# EAGLE design linearSensor (EAGLE 7.3.0)
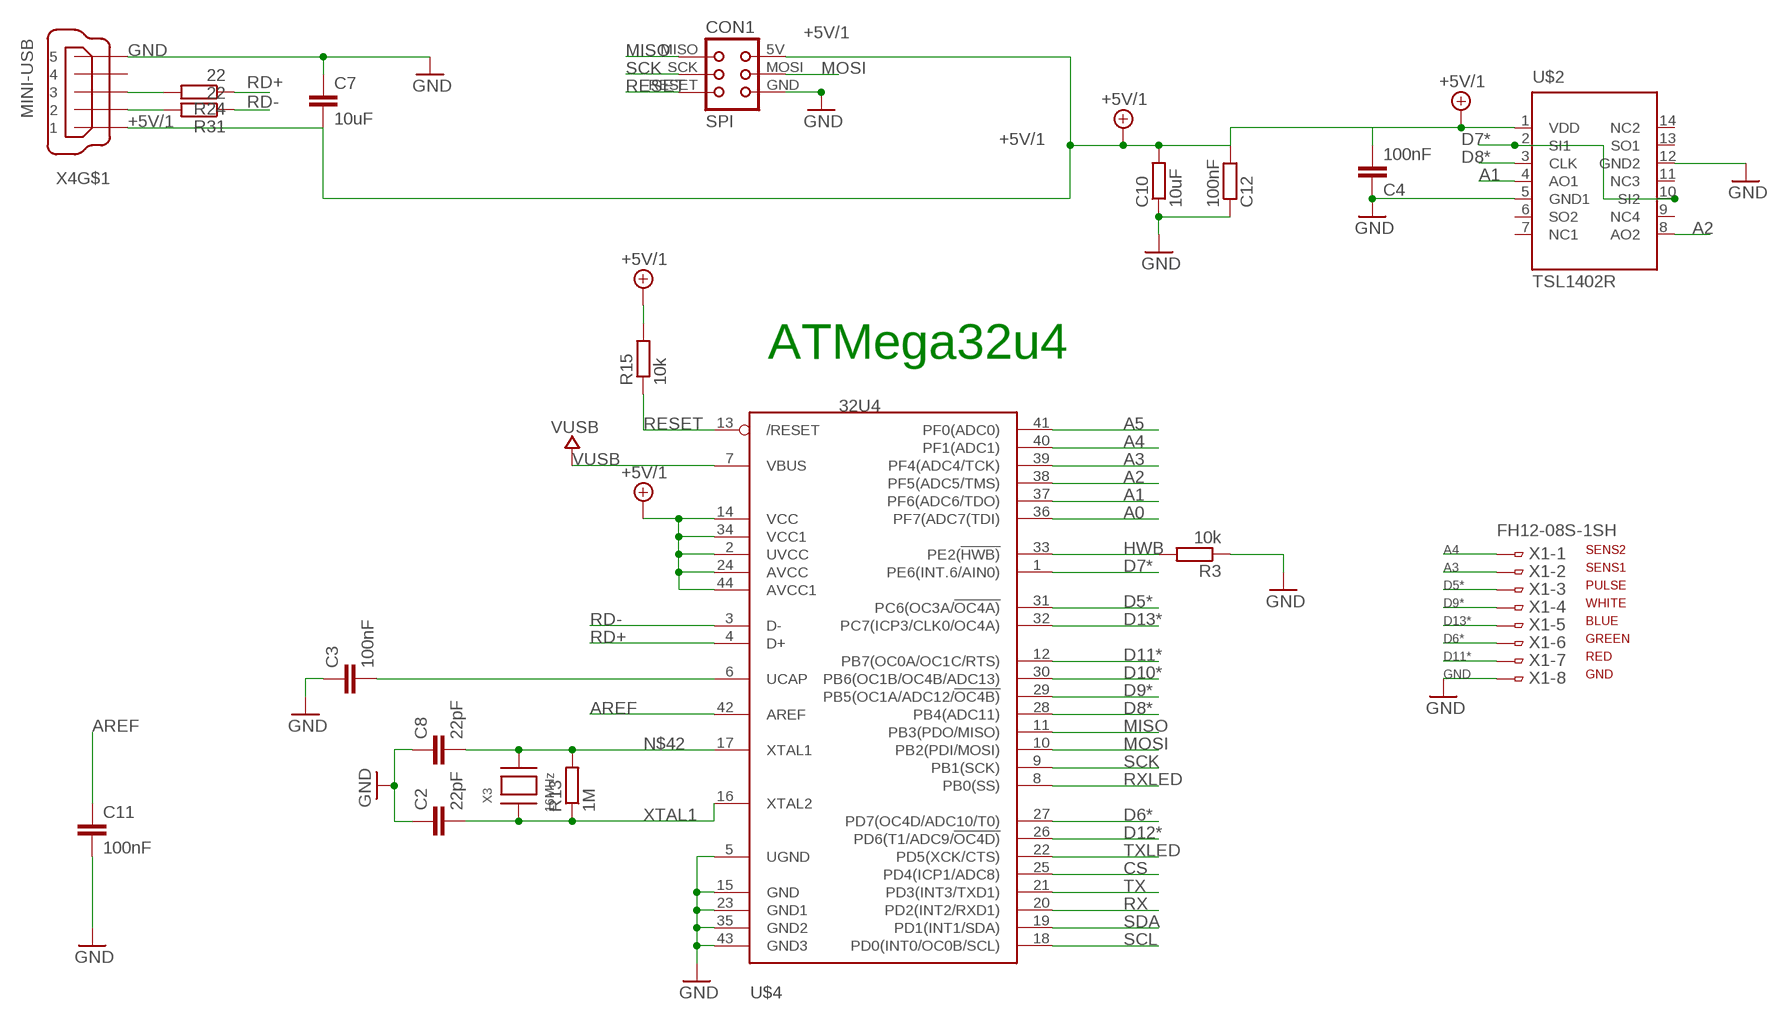
[diagram p0: schematic, sheet 1]

## Parts
C2  22pF  C-EUC0805K  [C0805K]
C3  100nF  C-EUC0805K  [C0805K]
C4  100nF  C-EUC0805  [C0805]
C7  10uF  C-EUC0805  [C0805]
C8  22pF  C-EUC0805K  [C0805K]
C10  10uF  R-EU_M0805  [M0805]
C11  100nF  C-EUC0805K  [C0805K]
C12  100nF  R-EU_M0805  [M0805]
CON1  SPI  TINYISPT  [TC2030-MCP-NL]
R3  10k  R-EU_M0805  [M0805]
R13  1M  R-EU_M0805  [M0805]
R15  10k  R-EU_M0805  [M0805]
R24  22  R-EU_M0805  [M0805]
R31  22  R-EU_M0805  [M0805]
U$2  TSL1402R  [DIL14]
U$4  32U4  ATMEGA32U4-AU  [TQFP44]
X1  FH12-08S-1SH  [FH12-08S-1SH]
X3  16MHz  XTALNX6035  [NX6035]
X4  MINI-USB  MINI-USB-SCHIELD-32005-201  [32005-201]

## Nets
+5V/1 [fine]: C4.2 C7.2 C10.2 C12.2 CON1.5V(VCC) R15.2 U$2.1(VDD) U$4.2(UVCC) U$4.14(VCC) U$4.24(AVCC) U$4.34(VCC1) U$4.44(AVCC1) X4.1
A0: U$4.36(PF7(ADC7(TDI))
A1: U$2.4(AO1) U$4.37(PF6(ADC6/TDO))
A2: U$2.8(AO2) U$4.38(PF5(ADC5/TMS))
A3: U$4.39(PF4(ADC4/TCK)) X1.2
A4: U$4.40(PF1(ADC1)) X1.1
A5: U$4.41(PF0(ADC0))
AREF: C11.1 U$4.42(AREF)
CS: U$4.25(PD4(ICP1/ADC8))
D5*: U$4.31(PC6(OC3A/!OC4A)) X1.3
D6*: U$4.27(PD7(OC4D/ADC10/T0)) X1.6
D7*: U$2.2(SI1) U$2.10(SI2) U$4.1(PE6(INT.6/AIN0))
D8*: U$2.3(CLK) U$4.28(PB4(ADC11))
D9*: U$4.29(PB5(OC1A/ADC12/!OC4B)) X1.4
D10*: U$4.30(PB6(OC1B/OC4B/ADC13))
D11*: U$4.12(PB7(OC0A/OC1C/RTS)) X1.7
D12*: U$4.26(PD6(T1/ADC9/!OC4D))
D13*: U$4.32(PC7(ICP3/CLK0/OC4A)) X1.5
D_USB+ [USBA]: R24.2 X4.3
D_USB- [USBA]: R31.2 X4.2
GND [power]: C2.1 C3.1 C4.1 C7.1 C8.1 C10.1 C11.2 C12.1 CON1.GND R3.1 U$2.5(GND1) U$2.12(GND2) U$4.5(UGND) U$4.15(GND) U$4.23(GND1) U$4.35(GND2) U$4.43(GND3) X1.8 X4.5
HWB: R3.2 U$4.33(PE2(!HWB))
MISO: CON1.MISO U$4.11(PB3(PDO/MISO))
MOSI: CON1.MOSI U$4.10(PB2(PDI/MOSI))
N$16: C3.2 U$4.6(UCAP)
N$42: C8.2 R13.2 U$4.17(XTAL1) X3.P$2
RD+ [USBB]: R24.1 U$4.4(D+)
RD- [USBB]: R31.1 U$4.3(D-)
RESET: CON1.RESET R15.1 U$4.13(/RESET)
RX: U$4.20(PD2(INT2/RXD1))
RXLED: U$4.8(PB0(SS))
SCK: CON1.SCK U$4.9(PB1(SCK))
SCL: U$4.18(PD0(INT0/OC0B/SCL))
SDA: U$4.19(PD1(INT1/SDA))
TX: U$4.21(PD3(INT3/TXD1))
TXLED: U$4.22(PD5(XCK/CTS))
VUSB: U$4.7(VBUS)
XTAL1: C2.2 R13.1 U$4.16(XTAL2) X3.P$1
Unconnected: U$2.6(SO2) U$2.7(NC1) U$2.9(NC4) U$2.11(NC3) U$2.13(SO1) U$2.14(NC2) X4.4 X4.M1(S:S1) X4.M2(S:S2) X4.M3(S:S3) X4.M4(S:S4)

## Notes on the sheet
- ATMega32u4
- SENS2
- SENS1
- PULSE
- WHITE
- BLUE
- GREEN
- RED
- GND

## Library data of the parts
C2-C4 C7 C8 C11 = rcl:C-EU: CAPACITOR, European symbol
C10 C12 R13 R24 R31 = rcl:R-EU_: RESISTOR, European symbol
CON1 = lpatiny:TINYISP: CONNECTOR
R3 R15 = resistor:R-EU_: RESISTOR, European symbol
U$2 = lpatiny:TSL1402R
U$4 = adafruit:ATMEGA32U4: http://www.ladyada.net/library/eagle
X1 = con-hirose:FH12-08S-1S: 1mm Pitch Connectors For FPC/FFC Source: Data sheet <http://www.hirose.co.jp/cataloge_hp/e58605370.pdf>; OC_FARNELL: unknown; OC_NEWARK: unknown
X3 = lpatiny:XTAL: Low cost SMT crystals, no capacitors included http://www.ladyada.net/library/eagle
X4 = con-cypressindustries:MINI-USB-SCHIELD-: MINI USB-B Conector Source: www.cypressindustries.com; OC_FARNELL: unknown; OC_NEWARK: unknown

## Net classes
0 default: width 0.254 mm
1 power: width 0.254 mm
2 VIN: width 0.254 mm
3 fine: width 0.254 mm
4 aref: width 0.254 mm
5 USBA: width 0.254 mm, clearance 0.254 mm
6 USBB: width 0.254 mm, clearance 0.254 mm

## Board
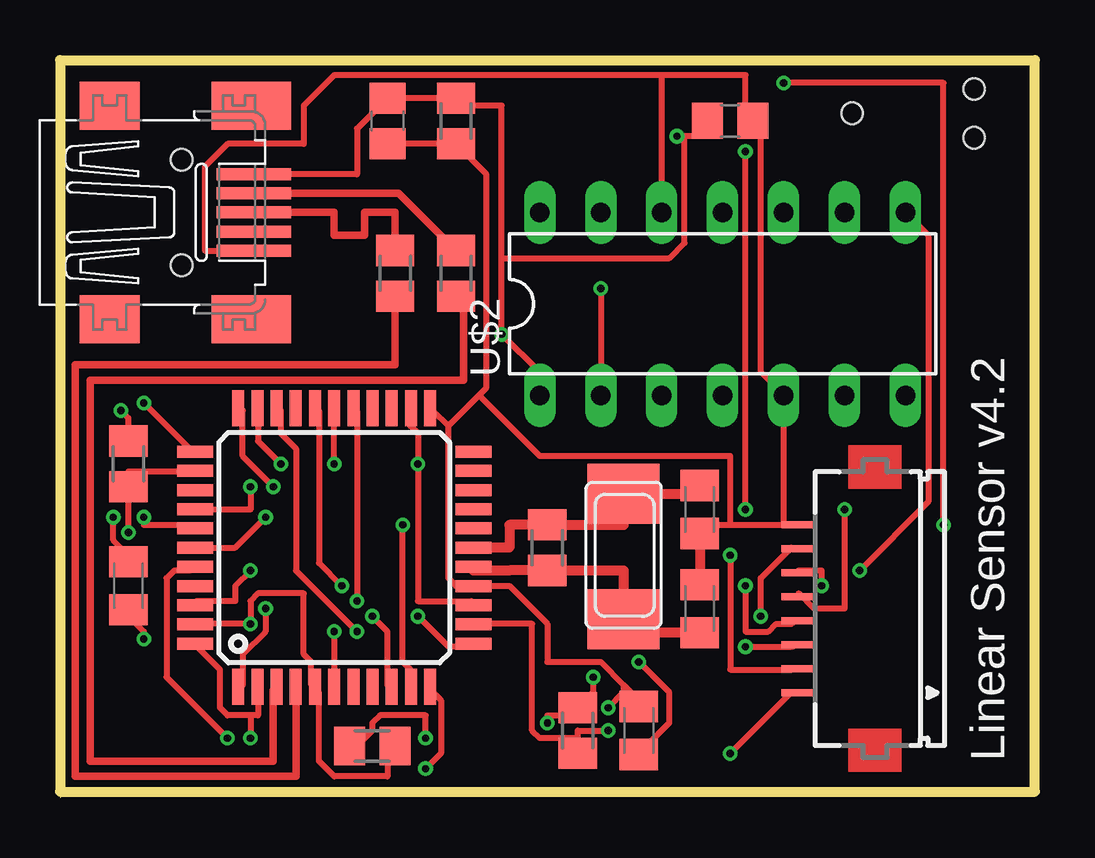
[diagram p1: board, top side]
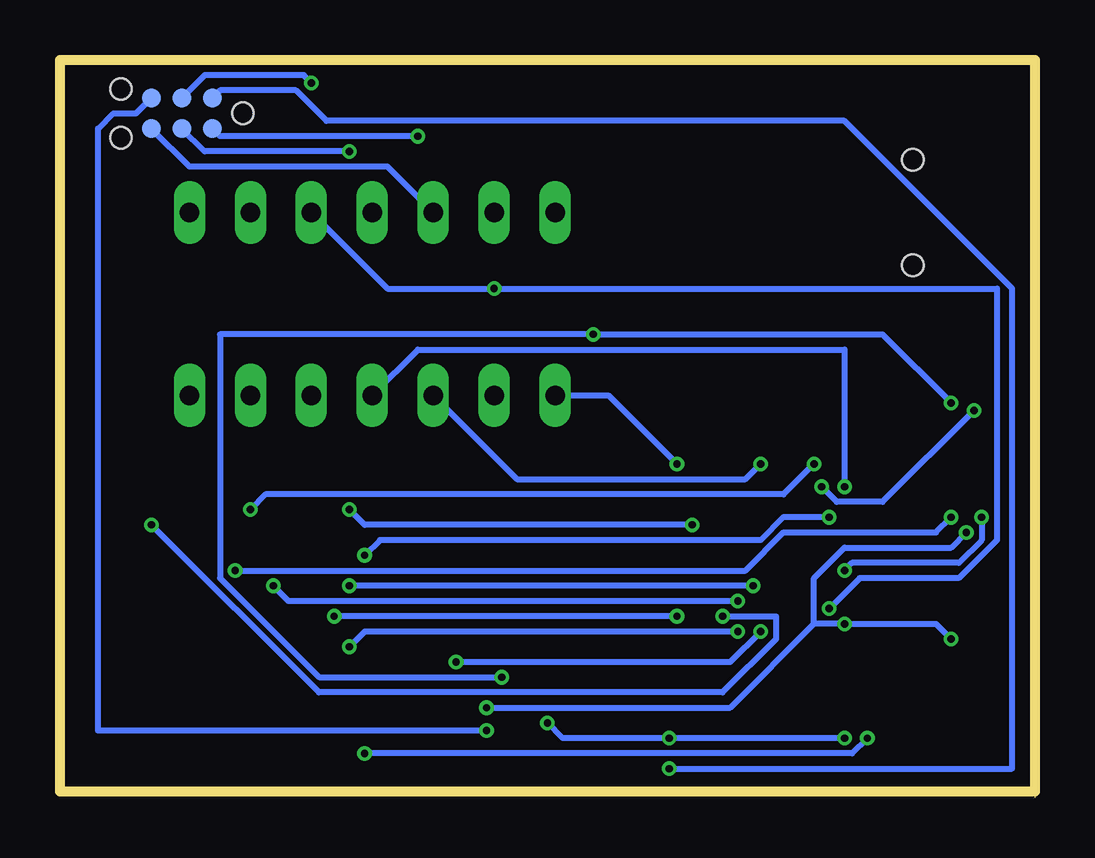
[diagram p2: board, bottom side, seen from below]

Size 40.64 x 30.73 mm. Coordinates in mm from the lower left corner, seen from the top.
Outline: 0,0.25 0,0
Outline: 0,0.25 0,30.73 40.64,30.73 40.64,0.25 0,0.25
Copper layers (1*16): Top 0.035mm / dielectric 1.5mm / Bottom 0.035mm
Design rules "Fusion_eagle_rule_v1.1": minimum track width 6mil, minimum drill 12mil, track to track 6mil, track to pad 6mil, pad to pad 6mil, via to via 6mil, smd to smd 0mil, copper to edge 10mil, drill to drill 10mil, minimum pad ring 10mil, minimum via ring 6mil, stop-mask expansion 2mil, vias tented up to drill 100mil, thermal gap 10mil
vRestrict: area 3.8,2.8 to 19.1,6.6; area 3.8,2.8 to 7.6,16.8; area 15.2,5.3 to 19.1,18; area 3.8,14.2 to 19.1,18; area 31.8,26.9 to 39.4,30.7

### Footprints (pad centres in the part's own frame; a part is rotated, then mirrored left to right if it is on the bottom)
C0805K = smd 1.3 x 1.6: 1 -1,0; 2 1,0
C0805 = smd 1.3 x 1.5: 1 -0.95,0; 2 0.95,0
M0805 = smd 1.3 x 1.6: 1 -0.95,0; 2 0.95,0
TC2030-MCP-NL = smd 0.787 x 0.787: 5V 1.27,0.635; GND 3.81,0.635; MISO 1.27,-0.635; MOSI 2.54,0.635; RESET 3.81,-0.635; SCK 2.54,-0.635 | hole 0.889: 0,0; 5.08,-1.016; 5.08,1.016
DIL14 = drill 0.813 long: 1 -7.62,-3.81; 2 -5.08,-3.81; 3 -2.54,-3.81; 4 0,-3.81; 5 2.54,-3.81; 6 5.08,-3.81; 7 7.62,-3.81; 8 7.62,3.81; 9 5.08,3.81; 10 2.54,3.81; 11 0,3.81; 12 -2.54,3.81; 13 -5.08,3.81; 14 -7.62,3.81
TQFP44 = smd 1.5 x 0.5: 1 -5.8,4; 2 -5.8,3.2; 3 -5.8,2.4; 4 -5.8,1.6; 5 -5.8,0.8; 6 -5.8,0; 7 -5.8,-0.8; 8 -5.8,-1.6; 9 -5.8,-2.4; 10 -5.8,-3.2; 11 -5.8,-4; 23 5.8,-4; 24 5.8,-3.2; 25 5.8,-2.4; 26 5.8,-1.6; 27 5.8,-0.8; 28 5.8,0; 29 5.8,0.8; 30 5.8,1.6; 31 5.8,2.4; 32 5.8,3.2; 33 5.8,4 | smd 0.5 x 1.5: 12 -4,-5.8; 13 -3.2,-5.8; 14 -2.4,-5.8; 15 -1.6,-5.8; 16 -0.8,-5.8; 17 0,-5.8; 18 0.8,-5.8; 19 1.6,-5.8; 20 2.4,-5.8; 21 3.2,-5.8; 22 4,-5.8; 34 4,5.8; 35 3.2,5.8; 36 2.4,5.8; 37 1.6,5.8; 38 0.8,5.8; 39 0,5.8; 40 -0.8,5.8; 41 -1.6,5.8; 42 -2.4,5.8; 43 -3.2,5.8; 44 -4,5.8
FH12-08S-1SH = smd 0.3 x 1.3: 1 -3.5,3.25; 2 -2.5,3.25; 3 -1.5,3.25; 4 -0.5,3.25; 5 0.5,3.25; 6 1.5,3.25; 7 2.5,3.25; 8 3.5,3.25
NX6035 = smd 2.5 x 3: P$1 2.665,0; P$2 -2.565,0
32005-201 = smd 3.1 x 0.5: 1 3,1.6; 2 3,0.8; 3 3,0; 4 3,-0.8; 5 3,-1.6 | smd 2.5 x 2: M1 -3,-4.45; M2 -3,4.45 | smd 3.3 x 2: M3 2.9,4.45; M4 2.9,-4.45 | hole 0.9: 0,2.2; 0,-2.2

### Placement (x,y rotation side)
C2  26.67,7.87 270 top
C3  24.13,2.79 270 top
C4  27.94,28.19 180 top
C7  13.65,28.19 90 top
C8  26.67,12 90 top
C10  16.51,28.19 90 top
C11  2.86,8.83 270 top
C12  13.02,2.16 180 top
CON1  33.02,28.51 180 bottom
R3  2.86,13.91 90 top
R13  20.32,10.41 90 top
R15  21.59,2.79 90 top
R24  13.97,21.84 90 top
R31  16.51,21.84 90 top
U$2  27.62,20.57 0 top
U$4  11.43,10.41 90 top
X1  33.97,7.87 90 top
X3  23.5,10.1 270 top
X4  5.08,24.38 0 top

### Tracks (layer width: path | path; a pad name or v marks a point on that pad's centre or on a via)
+5V/1  (via drill 0.3)
  Top 0.254: 7.94,3.43 8.26,3.43 8.26,4.38 U$4.2 | 7.94,3.43 6.99,3.43 6.67,3.75 6.67,5.33 5.71,6.29 U$4.44 | v15.24,2.48 15.24,3.43 13.34,3.43 13.02,3.11 13.02,2.79 12.38,2.16 C12.2 | 7.94,3.43 v7.94,2.48 | v20.32,3.11 20.32,3.43 21.59,3.43 R15.2 22.23,4.38 v22.23,5.02 | U$4.14 17.14,8.19 14.92,8.19 v14.92,13.91 14.92,15.18 14.61,15.49 14.61,16.13 U$4.24 | 26.04,27.56 26.99,27.56 C4.2 | 26.04,27.56 v25.72,27.56 | C7.2 C10.2 16.51,28.83 18.41,28.83 18.41,22.48 | v3.49,16.45 5.4,14.54 U$4.34 | U$2.1 20,17.72 v18.41,19.3 18.41,22.48 | C7.2 12.38,27.88 12.38,25.97 8.26,25.97 X4.1 | C7.2 | 26.04,27.56 26.04,23.11 25.4,22.48 18.41,22.48
  Bottom 0.254: v7.94,2.48 v15.24,2.48 19.68,2.48 v20.32,3.11 | CON1.5V 33.97,27.56 v25.72,27.56 | v3.49,16.45 6.35,19.3 v18.41,19.3 33.97,19.3 33.97,9.14 29.84,5.02 v22.23,5.02 | v14.92,13.91 17.78,16.76 U$2.1
A1  (via drill 0.3)
  Top 0.254: v7.94,12.95 7.94,12 5.71,12 U$4.37
  Bottom 0.254: v7.94,12.95 7.94,18.67 25.72,18.67 U$2.4
A2  (via drill 0.3)
  Top 0.254: v3.49,11.68 3.49,11.37 5.4,11.37 U$4.38 | v33.34,9.46 36.2,12.32 36.2,23.43 U$2.8
  Bottom 0.254: v3.49,11.68 4.13,11.05 10.48,11.05 12.06,9.46 v33.34,9.46
A3  (via drill 0.3)
  Top 0.254: v27.94,10.1 27.94,5.33 30.48,5.33 X1.2 | v8.57,11.68 7.3,10.41 U$4.39
  Bottom 0.254: v27.94,10.1 27.3,10.73 11.43,10.73 10.48,11.68 v8.57,11.68
A4  (via drill 0.3)
  Top 0.254: v27.94,1.84 30.48,4.38 X1.1 | v6.99,2.48 4.45,5.02 4.45,9.14 4.76,9.46 5.4,9.46 U$4.40
  Bottom 0.254: v27.94,1.84 7.62,1.84 v6.99,2.48
AREF  (via drill 0.3)
  Top 0.254: v7.94,9.46 7.3,8.83 7.3,8.19 5.71,8.19 U$4.42 | v2.22,11.68 2.22,10.73 2.86,10.1 C11.1
  Bottom 0.254: v7.94,9.46 7.62,9.78 3.17,9.78 2.22,10.73 v2.22,11.68
D5*  (via drill 0.3)
  Top 0.254: v28.57,6.29 30.48,6.29 X1.3 | v12.38,6.92 9.84,9.46 9.84,14.54 9.21,15.18 9.21,16.13 U$4.31
  Bottom 0.254: v28.57,6.29 27.94,6.92 v12.38,6.92
D6*  (via drill 0.3)
  Top 0.254: v31.75,8.83 31.75,9.46 30.8,9.46 X1.6 | v12.38,8.19 12.38,16.13 U$4.27
  Bottom 0.254: v31.75,8.83 31.11,8.19 v12.38,8.19
D7*  (via drill 0.3)
  Top 0.254: v8.57,7.87 8.57,6.92 7.62,5.97 7.62,4.7 U$4.1 | v22.54,21.21 U$2.2
  Bottom 0.254: v8.57,7.87 7.3,9.14 3.17,9.14 1.59,10.73 1.59,21.21 v22.54,21.21 26.99,21.21 U$2.10
D8*  (via drill 0.3)
  Top 0.254: v11.43,13.91 U$4.28
  Bottom 0.254: v11.43,13.91 12.06,13.27 21.59,13.27 U$2.3
D9*  (via drill 0.3)
  Top 0.254: v28.57,8.83 28.57,6.92 29.53,6.92 29.84,7.24 30.48,7.24 X1.4 | v11.75,8.83 10.79,9.78 10.79,16.13 U$4.29
  Bottom 0.254: v11.75,8.83 v28.57,8.83
D11*  (via drill 0.3)
  Top 0.254: v29.21,7.56 29.21,9.14 30.48,10.41 X1.7 | v14.92,7.56 16.19,6.29 17.14,6.29 U$4.12
  Bottom 0.254: v14.92,7.56 v29.21,7.56
D13*  (via drill 0.3)
  Top 0.254: v32.7,12 32.7,7.87 31.43,7.87 30.8,8.51 X1.5 | v9.21,13.91 8.26,14.86 8.26,16.13 U$4.32
  Bottom 0.254: v32.7,12 32.07,12.64 10.48,12.64 v9.21,13.91
D_USB+
  Top 0.305: X4.3 11.43,24.38 11.43,23.43 12.7,23.43 12.7,24.38 13.97,24.38 R24.2
  Top 0.406: X4.3 7.62,24.38
D_USB-
  Top 0.305: X4.2 14.12,25.18 R31.2
GND  (via drill 0.3)
  Top 0.254: U$4.35 5.4,13.59 2.86,13.59 R3.1 v2.86,11.05 | C12.1 13.65,2.16 13.65,0.89 11.43,0.89 10.79,1.52 10.79,4.38 U$4.5 10.48,4.7 10.48,5.65 10.16,5.97 10.16,8.51 8.26,8.51 7.94,8.19 v7.94,7.24 5.71,7.24 U$4.43 | v3.49,6.6 3.49,6.92 2.86,7.56 C11.2 | C10.1 C7.1 | 16.19,15.49 15.56,16.13 U$4.23 | 16.19,15.49 16.19,9.14 16.51,8.83 17.14,8.83 U$4.15 17.46,8.83 18.73,8.83 20.32,7.24 20.32,5.65 22.54,5.65 23.5,4.7 | 23.5,4.7 24.13,4.06 C3.1 | C10.1 17.78,25.97 17.78,17.08 17.46,16.76 | 16.19,15.49 17.46,16.76 | C10.1 | v22.86,3.75 23.5,4.38 23.5,4.7 | 27.94,11.37 26.67,11.37 C8.1 | 27.94,11.37 30.16,11.37 | 30.16,11.37 30.48,11.37 X1.8 30.16,11.37 | 30.16,11.37 U$2.5 29.21,17.72 29.21,27.88 C4.1 28.57,28.19 28.57,30.1 25.08,30.1 | 25.08,30.1 11.43,30.1 10.16,28.83 10.16,27.24 6.99,27.24 6.03,26.29 6.03,22.8 7.94,22.8 X4.5 | 25.08,30.1 U$2.12 | 17.46,16.76 20,14.22 27.94,14.22 27.94,11.37
  Top 0.406: C8.1 C2.1
  Bottom 0.254: v3.49,6.6 4.13,7.24 v7.94,7.24 9.21,7.24 | v2.86,11.05 3.49,10.41 7.94,10.41 9.21,9.14 9.21,7.24 | 9.21,7.24 12.7,3.75 v22.86,3.75 | CON1.GND 35.24,26.29 26.99,26.29 U$2.12
HWB  (via drill 0.3)
  Top 0.254: v8.89,12.95 7.62,14.22 7.62,16.13 U$4.33 | v2.54,16.13 2.86,15.81 R3.2
  Bottom 0.254: v8.89,12.95 8.26,12.32 6.35,12.32 v2.54,16.13
MISO  (via drill 0.3)
  Top 0.254: v15.24,1.21 15.88,1.84 15.88,4.06 15.56,4.38 U$4.11
  Bottom 0.254: CON1.MISO 33.97,29.46 30.8,29.46 29.53,28.19 7.94,28.19 0.95,21.21 0.95,1.21 v15.24,1.21
MOSI  (via drill 0.3)
  Top 0.254: v28.57,12 v28.57,26.92 | v14.29,11.37 14.29,5.65 14.61,5.33 14.61,4.7 U$4.10
  Bottom 0.254: CON1.MOSI 34.61,26.92 v28.57,26.92 | v28.57,12 27.94,11.37 v14.29,11.37
N$16  (via drill 0.3)
  Top 0.254: v11.43,6.92 U$4.6 | v24.13,5.65 25.4,4.38 25.4,3.11 24.13,1.84 C3.2
  Bottom 0.254: v11.43,6.92 12.7,5.65 v24.13,5.65
N$42
  Top 0.406: U$4.17 18.73,10.41 18.73,11.36 R13.2 23.5,11.36 X3.P$2 26.67,12.66 C8.2
RD+
  Top 0.305: R24.1 13.97,18.03 0.64,18.03 0.64,0.89 9.84,0.89 9.84,4.6 U$4.4
RD-
  Top 0.305: U$4.3 8.89,4.47 8.89,1.52 1.27,1.52 1.27,17.4 16.83,17.4 16.83,20.89 R31.1
RESET  (via drill 0.3)
  Top 0.254: v22.86,2.79 21.59,2.79 21.59,2.48 | 21.59,2.48 R15.1 21.59,2.16 | 21.59,2.48 20,2.48 19.68,2.79 19.68,7.24 17.46,7.24 U$4.13
  Bottom 0.254: CON1.RESET 37.47,28.51 38.42,28.51 39.05,27.88 39.05,2.79 v22.86,2.79
SCK  (via drill 0.3)
  Top 0.254: v30.16,29.78 36.83,29.78 v36.83,11.37 | v13.02,7.56 13.65,6.92 13.65,4.7 U$4.9
  Bottom 0.254: CON1.SCK 34.61,30.1 30.48,30.1 v30.16,29.78 | v36.83,11.37 29.84,4.38 13.02,4.38 10.79,6.6 10.79,7.56 v13.02,7.56
XTAL1
  Top 0.406: U$4.16 17.23,9.46 18.73,9.46 R13.1 23.5,9.46 X3.P$1 23.5,6.87 C2.2

### Text on the board
tPlace: Linear Sensor v4.2
203bmp: C:/Users/G/Pictures/logo_epfl.bmp